# Altium schematic sheet btl.SchDoc
size A3; SheetNumber: 1; SheetTotal: 1
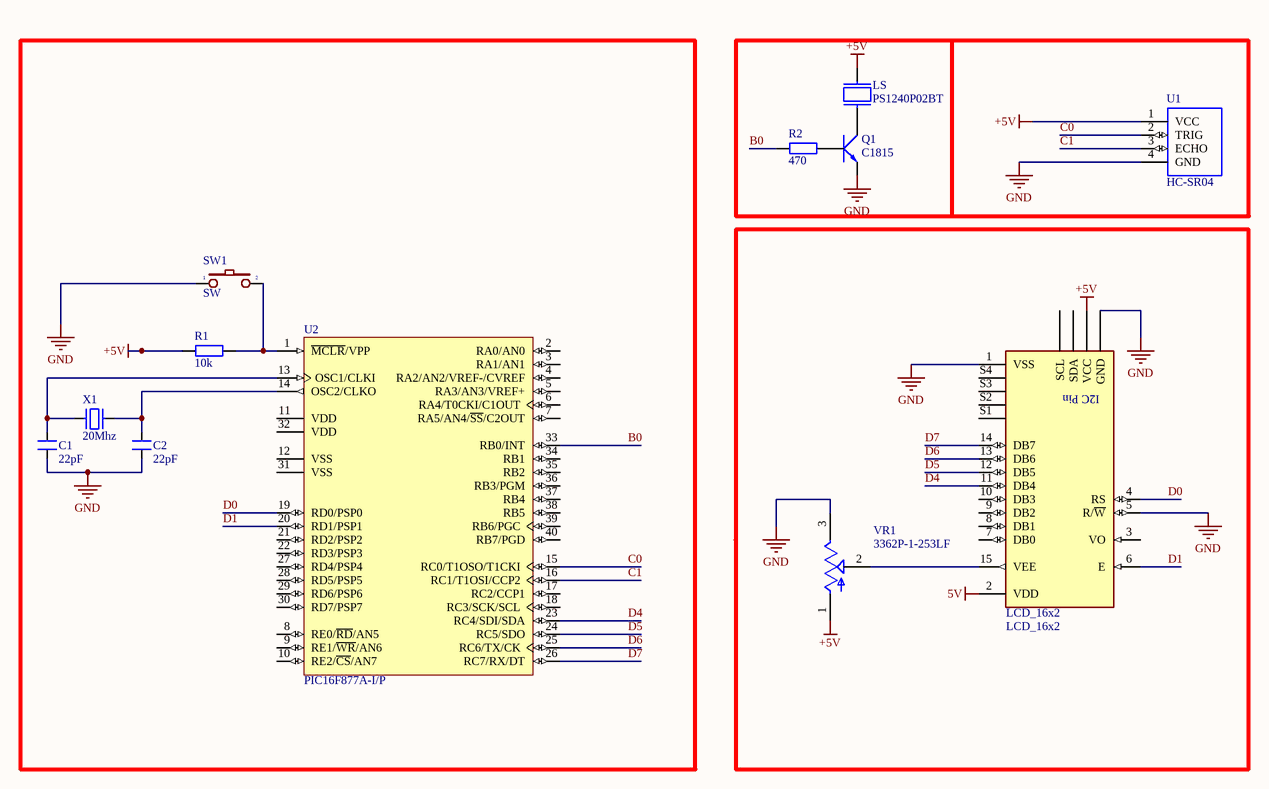
[diagram p0: btl.SchDoc]

## Parts
C1  22pF  [CN2]
C2  22pF  [CN2]
LCD_16x2  LCD_16x2  [LCD_16x2]
LS  PS1240P02BT  [XDCR_PS1240P02BT]
Q1  C1815  [QTO-92]
R1  10k  [R1/4W]
R2  470  [R1/4W]
SW1  SW  [SW2]
U1  HC-SR04  [XCVR_HC-SR04]
U2  PIC16F877A-I/P  [PDIP600-P40]
VR1  3362P-1-253LF  [TRIM_3362P-1-253LF]
X1  20Mhz  [XT2]

## Nets
5V: LCD_16x2.2(VDD)
+5V: LCD_16x2.VCC LS.2 R1.1 U1.1(VCC) VR1.1(CCW)
GND: C1.1 C2.1 LCD_16x2.1(VSS) LCD_16x2.5(R/~{W}) LCD_16x2.GND Q1.1(E) SW1.1 U1.4(GND) VR1.3(CW)
B0: R2.1 U2.33(RB0/INT)
C0: U1.2(TRIG) U2.15(RC0/T1OSO/T1CKI)
C1: U1.3(ECHO) U2.16(RC1/T1OSI/CCP2)
D0: LCD_16x2.4(RS) U2.19(RD0/PSP0)
D1: LCD_16x2.6(E) U2.20(RD1/PSP1)
D4: LCD_16x2.11(DB4) U2.23(RC4/SDI/SDA)
D5: LCD_16x2.12(DB5) U2.24(RC5/SDO)
D6: LCD_16x2.13(DB6) U2.25(RC6/TX/CK)
D7: LCD_16x2.14(DB7) U2.26(RC7/RX/DT)
NetC1_2: C1.2 U2.13(OSC1/CLKI) X1.1
NetC2_2: C2.2 U2.14(OSC2/CLKO) X1.2
NetLCD_16x2_15: LCD_16x2.15(VEE) VR1.2(WIPER)
NetLS_1: LS.1 Q1.2(C)
NetQ1_3: Q1.3(B) R2.2
NetR1_2: R1.2 SW1.2 U2.1(~{MCLR}/VPP)

Not connected (* = marked no-connect by the designer): LCD_16x2 3(VO) 7(DB0) 8(DB1) 9(DB2) 10(DB3) S1(SHIELD) S2(SHIELD) S3(SHIELD) S4(SHIELD) SCL SDA; U2 2(RA0/AN0) 3(RA1/AN1) 4(RA2/AN2/VREF-/CVREF) 5(RA3/AN3/VREF+) 6(RA4/T0CKI/C1OUT) 7(RA5/AN4/~{SS}/C2OUT) 8(RE0/~{RD}/AN5) 9(RE1/~{WR}/AN6) 10(RE2/~{CS}/AN7) 11(VDD) 12(VSS) 17(RC2/CCP1) 18(RC3/SCK/SCL) 21(RD2/PSP2) 22(RD3/PSP3) 27(RD4/PSP4) 28(RD5/PSP5) 29(RD6/PSP6) 30(RD7/PSP7) 31(VSS) 32(VDD) 34(RB1) 35(RB2) 36(RB3/PGM) 37(RB4) 38(RB5) 39(RB6/PGC) 40(RB7/PGD)

## Notes on the sheet
- (in symbol LCD_16x2) I2C Pin

## Library data of the parts
C1 C2 = CN2: Cap np 104 => 105pF; Value: 0.1uF
LCD_16x2 = LCD_16x2: Display: LCD; alphanumeric; STN Negative; 16x2; blue; LED; PIN: 16; MP: RC1602B-BIW-CSV; Price: None; Value: *; Availability: Unavailable; Package: None
LS = PS1240P02BT: Buzzers Transducer, Externally Driven Piezo 3V 4kHz 60dB @ 3V, 10cm Through Hole PC Pins; MF: TDK; MP: PS1240P02BT; Availability: Unavailable; Package: 2020 TDK; Value: *; Price: None; SnapEDA_Link: https://www.snapeda.com/parts/PS1240P02BT/TDK/view-part/53420/?ref=snap
Q1 = C1815: NPN 600mW, ECB; Value: C1815
R1 R2 = R1/4W: Resistor 1/4W; Value: R1/4W - 1K
SW1 = SW2: Switch button 2 pin; Value: SW chip 2 pin
U1 = HC-SR04: Ultrasonic Sensor Module; Availability: Unavailable; MP: HC-SR04; Value: *; Price: None; Package: None
U2 = PIC16F877A-I/P: Enhanced FLASH Microcontroller, 8K (x14-Bit words) FLASH, 368 Bytes RAM, 40-Pin PDIP, Standard VDD Range, Industrial Temperature; ComponentAvailability: Unknown. Contact manufacturer to determine status.; Published: 11-Oct-2004; LatestRevisionDate: 29-Jan-2009; LatestRevisionNote: Sch. layout revised. 3D Model Removed.; DatasheetVersion: revB, Oct-2003; PackageVersion: revBB, Aug-2009; PackageReference: PDIP600-P40; Publisher: Altium Limited; PackageDescription: 40-Lead Plastic Dual In-Line (P) - 600 mil Body [PDIP]; Supplier 1: Digi-Key; Supplier Part Number 1: PIC16F877A-I/P-ND; Supplier 2: Farnell; Supplier Part Number 2: 1523966; Supplier 3: Farnell; Supplier Part Number 3: 9761446; ComponentLink1Description: Datasheet; ComponentLink1URL: http://ww1.microchip.com/downloads/en/DeviceDoc/39582b.pdf; ComponentLink2Description: Packaging Specification; ComponentLink2URL: http://www.microchip.com/stellent/groups/techpub_sg/documents/packagingspec/en012702.pdf; ComponentLink3Description: Microchip.com Home; ComponentLink3URL: http://www.microchip.com/
VR1 = 3362P-1-253LF: 25 kOhms 0.5W, 1/2W PC Pins Through Hole Trimmer Potentiometer Cermet 1.0 Turn Top Adjustment; MF: Bourns; SnapEDA_Link: https://www.snapeda.com/parts/3362P-1-253LF/Bourns/view-part/?ref=snap; Price: None; Check_prices: https://www.snapeda.com/parts/3362P-1-253LF/Bourns/view-part/?ref=eda; Purchase-URL: https://pricing.snapeda.com/search/part/3362P-1-253LF/?ref=eda; MP: 3362P-1-253LF; Value: *; Availability: In Stock; Package: 3362P-1 Bourns Inc.
X1 = XT2: Crystal For all Crystal 2pin.; Value: 4Mhz